# Altium project 皮肤热疗.PrjPCB
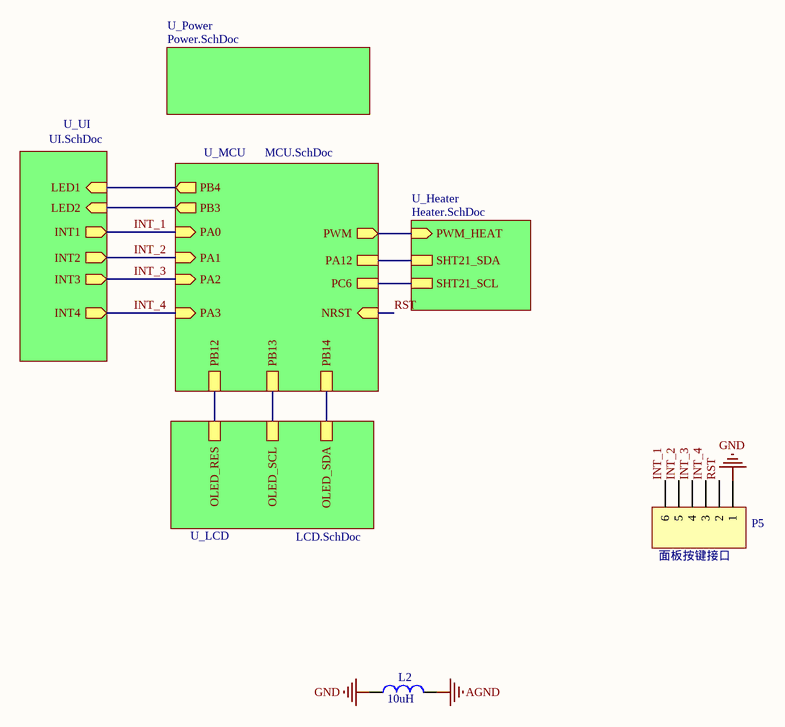
[diagram p0: Top.SchDoc]
6 sheets, 64 parts. Net scope: hierarchical (ports join the sheet entries above them; power ports are global).
Board file: 皮肤热疗.PcbDoc
Sheets:
  Top.SchDoc
    U_MCU = MCU.SchDoc
    U_Heater = Heater.SchDoc
    U_LCD = LCD.SchDoc
    U_Power = Power.SchDoc
    U_UI = UI.SchDoc

## Sheet Top.SchDoc
size A4

### Parts
L2  value 10uH  [0805]  (hidden comment: Inductor)
P5  面板按键接口  [软排线插座6P-0.5mm]

### Sub-sheets
U_Heater = Heater.SchDoc: SHT21_SCL, SHT21_SDA, PWM_HEAT (in)
U_LCD = LCD.SchDoc: OLED_SDA, OLED_SCL, OLED_RES
U_MCU = MCU.SchDoc: PWM (out), NRST (in), PA0 (in), PA1 (in), PA2 (in), PA3 (in), PB12, PB13, PB14, PB3 (out), PB4 (out), PC6, PA12
U_Power = Power.SchDoc: no entries
U_UI = UI.SchDoc: INT1 (out), INT2 (out), INT3 (out), INT4 (out), LED1 (in), LED2 (in)

### Nets
AGND: L2.2
GND: L2.1 P5.1
INT_1: P5.6 ; sheet U_MCU/PA0, sheet U_UI/INT1
INT_2: P5.5 ; sheet U_MCU/PA1, sheet U_UI/INT2
INT_3: P5.4 ; sheet U_MCU/PA2, sheet U_UI/INT3
INT_4: P5.3 ; sheet U_MCU/PA3, sheet U_UI/INT4
RST: P5.2 ; sheet U_MCU/NRST  [project net NRST]
NetQ1_1: sheet U_MCU/PWM, sheet U_Heater/PWM_HEAT
NetR1_2: sheet U_MCU/PC6, sheet U_Heater/SHT21_SCL
NetR2_2: sheet U_MCU/PA12, sheet U_Heater/SHT21_SDA
NetR19_2: sheet U_MCU/PB4, sheet U_UI/LED1
NetR20_2: sheet U_MCU/PB3, sheet U_UI/LED2
NetU2_3: sheet U_MCU/PB14, sheet U_LCD/OLED_SDA
NetU2_4: sheet U_MCU/PB13, sheet U_LCD/OLED_SCL
NetU2_5: sheet U_MCU/PB12, sheet U_LCD/OLED_RES

### Library data of the parts
P5 = Header 6: Header, 6-Pin; LatestRevisionDate: 17-Jul-2002; LatestRevisionNote: Re-released for DXP Platform.; Publisher: Altium Limited

## Sheet MCU.SchDoc
size A4
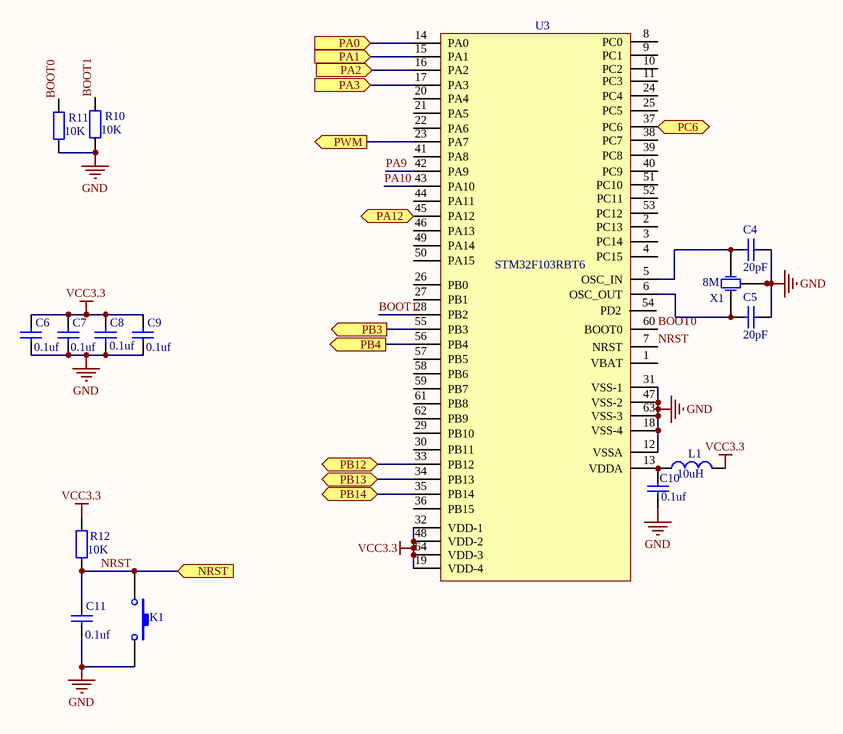
[diagram p1: MCU.SchDoc]

### Parts
C4  value 20pF  [0603]  (hidden comment: Capacitor-0805)
C5  value 20pF  [0603]  (hidden comment: Capacitor-0805)
C6  value 0.1uf  [0603]  (hidden comment: Capacitor-0603)
C7  value 0.1uf  [0603]  (hidden comment: Capacitor-0603)
C8  value 0.1uf  [0603]  (hidden comment: Capacitor-0603)
C9  value 0.1uf  [0603]  (hidden comment: Capacitor-0603)
C10  value 0.1uf  [0603]  (hidden comment: Capacitor-0603)
C11  value 0.1uf  [0603]  (hidden comment: Capacitor-0603)
K1  按键  [mini按键]  (value not drawn)
L1  value 10uH  [0805]  (hidden comment: Inductor)
R10  value 10K  [0603]  (hidden comment: Resistor-0603)
R11  value 10K  [0603]  (hidden comment: Resistor-0603)
R12  value 10K  [0603]  (hidden comment: Resistor-0603)
U3  STM32F103RBT6  [STM32F103RBT6]
X1  value 8M  [3225无源晶振]  (hidden comment: 3225无源晶振)

### Ports
NRST (in), PA0 (in), PA1 (in), PA2 (in), PA3 (in), PA12, PB3 (out), PB4 (out), PB12, PB13, PB14, PC6, PWM (out)

### Nets
GND: C4.1 C5.1 C6.1 C7.1 C8.1 C9.1 C10.1 C11.1 K1.2 R10.1 R11.1 U3.12(VSSA) U3.18(VSS-4) U3.31(VSS-1) U3.47(VSS-2) U3.63(VSS-3) X1.2(GND) X1.4(GND)
VCC3.3: C6.2 C7.2 C8.2 C9.2 L1.2 R12.2 U3.19(VDD-4) U3.32(VDD-1) U3.48(VDD-2) U3.64(VDD-3)
BOOT0: R11.2 U3.60(BOOT0)
BOOT1: R10.2 U3.28(PB2)
INT_1: U3.14(PA0) ; port PA0
INT_2: U3.15(PA1) ; port PA1
INT_3: U3.16(PA2) ; port PA2
INT_4: U3.17(PA3) ; port PA3
NRST: C11.2 K1.1 R12.1 U3.7(NRST) ; port NRST
PA9: U3.42(PA9)
PA10: U3.43(PA10)
NetC4_2: C4.2 U3.5(OSC_IN) X1.3(OSC2)
NetC5_2: C5.2 U3.6(OSC_OUT) X1.1(OSC1)
NetC10_2: C10.2 L1.1 U3.13(VDDA)
NetQ1_1: U3.23(PA7) ; port PWM
NetR1_2: U3.37(PC6) ; port PC6
NetR2_2: U3.45(PA12) ; port PA12
NetR19_2: U3.56(PB4) ; port PB4
NetR20_2: U3.55(PB3) ; port PB3
NetU2_3: U3.35(PB14) ; port PB14
NetU2_4: U3.34(PB13) ; port PB13
NetU2_5: U3.33(PB12) ; port PB12

Not connected (* = marked no-connect by the designer): U3 1(VBAT) 2(PC13) 3(PC14) 4(PC15) 8(PC0) 9(PC1) 10(PC2) 11(PC3) 20(PA4) 21(PA5) 22(PA6) 24(PC4) 25(PC5) 26(PB0) 27(PB1) 29(PB10) 30(PB11) 36(PB15) 38(PC7) 39(PC8) 40(PC9) 41(PA8) 44(PA11) 46(PA13) 49(PA14) 50(PA15) 51(PC10) 52(PC11) 53(PC12) 54(PD2) 57(PB5) 58(PB6) 59(PB7) 61(PB8) 62(PB9)

### Library data of the parts
C4 C5 = Capacitor-0
U3 = STM32F103RBT6: Name: STM32F103RBT6

## Sheet Heater.SchDoc
size A4
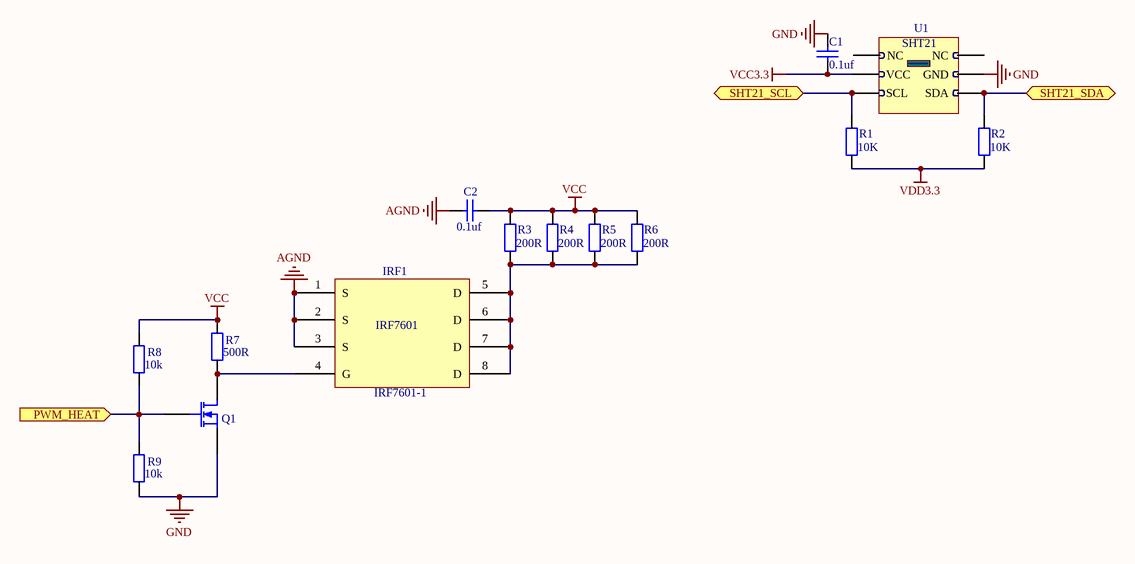
[diagram p2: Heater.SchDoc]

### Parts
C1  value 0.1uf  [0603]  (hidden comment: Capacitor-0603)
C2  value 0.1uf  [0603]  (hidden comment: Capacitor-0603)
IRF1  IRF7601-1  [IRF7601_Micro]
Q1  MOSFET_N  [MOSFET_N]  (value not drawn)
R1  value 10K  [0603]  (hidden comment: Resistor-0603)
R2  value 10K  [0603]  (hidden comment: Resistor-0603)
R3  value 200R  [0805]  (hidden comment: Resistor-0805)
R4  value 200R  [0805]  (hidden comment: Resistor-0805)
R5  value 200R  [0805]  (hidden comment: Resistor-0805)
R6  value 200R  [0805]  (hidden comment: Resistor-0805)
R7  value 500R  [0603]  (hidden comment: Resistor-0603)
R8  value 10k  [0603]  (hidden comment: Resistor-0603)
R9  value 10k  [0603]  (hidden comment: Resistor-0603)
U1  SHIT21  [SHT21]  (value not drawn)

### Ports
PWM_HEAT (in), SHT21_SCL, SHT21_SDA

### Nets
AGND: C2.2 IRF1.1(S) IRF1.2(S) IRF1.3(S)
GND: C1.2 Q1.2(S) R9.1 U1.4(GND)
VCC: C2.1 R3.2 R4.2 R5.2 R6.2 R7.2 R8.2
VCC3.3: C1.1 U1.3(VCC)
VDD3.3: R1.1 R2.1
NetIRF1_4: IRF1.4(G) Q1.3(D) R7.1
NetIRF1_5: IRF1.5(D) IRF1.6(D) IRF1.7(D) IRF1.8(D) R3.1 R4.1 R5.1 R6.1
NetQ1_1: Q1.1(G) R8.1 R9.2 ; port PWM_HEAT
NetR1_2: R1.2 U1.5(SCL) ; port SHT21_SCL
NetR2_2: R2.2 U1.6(SDA) ; port SHT21_SDA

Not connected (* = marked no-connect by the designer): U1 1(NC) 2(NC)

### Library data of the parts
IRF1 = Component_1: IRF7601
Q1 = MOSFET_N: Value: AP2306N; Name: MOSFET_N
U1 = SHIT21: Name: SHT21

## Sheet LCD.SchDoc
size A4
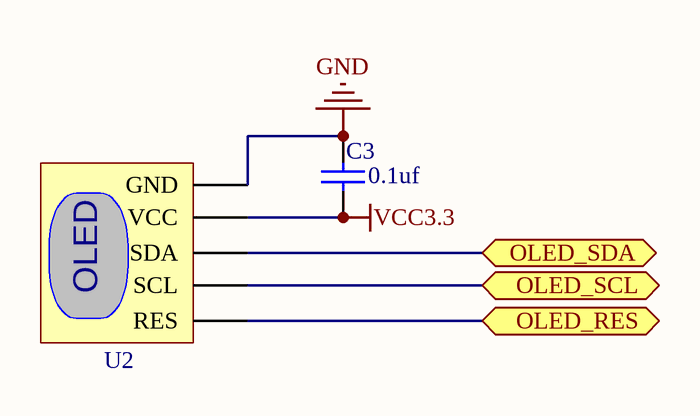
[diagram p3: LCD.SchDoc]

### Parts
C3  value 0.1uf  [0603]  (hidden comment: Capacitor-0603)
U2  0.49OLED  [0.49OLED]  (value not drawn)

### Ports
OLED_RES, OLED_SCL, OLED_SDA

### Nets
GND: C3.2 U2.1(GND)
VCC3.3: C3.1 U2.2(VCC)
NetU2_3: U2.3(SDA) ; port OLED_SDA
NetU2_4: U2.4(SCL) ; port OLED_SCL
NetU2_5: U2.5(RES) ; port OLED_RES

### Notes on the sheet
- (in symbol 0.49OLED) OLED

### Library data of the parts
U2 = 0.49OLED: Name: 0.49OLED

## Sheet Power.SchDoc
size A4
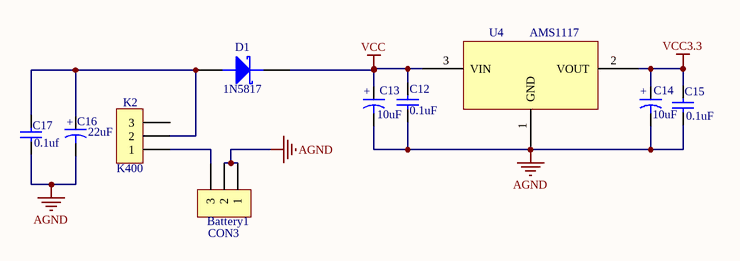
[diagram p4: Power.SchDoc]

### Parts
Battery1  CON3  [J-SOURCE-micro]
C12  value 0.1uF  [0805]  (hidden comment: Capacitor-0805)
C13  value 10uF  [钽电容1206（A3216）]  (hidden comment: 电解电容)
C14  value 10uF  [钽电容1206（A3216）]  (hidden comment: 电解电容)
C15  value 0.1uF  [0805]  (hidden comment: Capacitor-0805)
C16  value 22uF  [钽电容1206（A3216）]  (hidden comment: 电解电容)
C17  value 0.1uf  [0603]  (hidden comment: Capacitor-0603)
D1  1N5817  [1808]
K2  K400  [SS-12D01-edit]
U4  Name: AMS1117  [AMS1117-3.3(SOT-23)]  (hidden comment: AMS1117-3.3)

### Nets
AGND: Battery1.1 Battery1.2 C12.1 C13.1 C14.1 C15.1 C16.1 C17.1 U4.1(GND)
VCC: C12.2 C13.2 D1.2(K) U4.3(VIN)
VCC3.3: C14.2 C15.2 U4.2(VOUT)
NetBattery1_3: Battery1.3 K2.1
NetC16_2: C16.2 C17.2 D1.1(A) K2.2

Not connected (* = marked no-connect by the designer): K2 3

### Notes on the sheet
- (in symbol 电解电容) +

### Library data of the parts
Battery1 K2 = CON3: Connector
D1 = DIODE SCHOTTKY: Schottky Diode

## Sheet UI.SchDoc
size A4
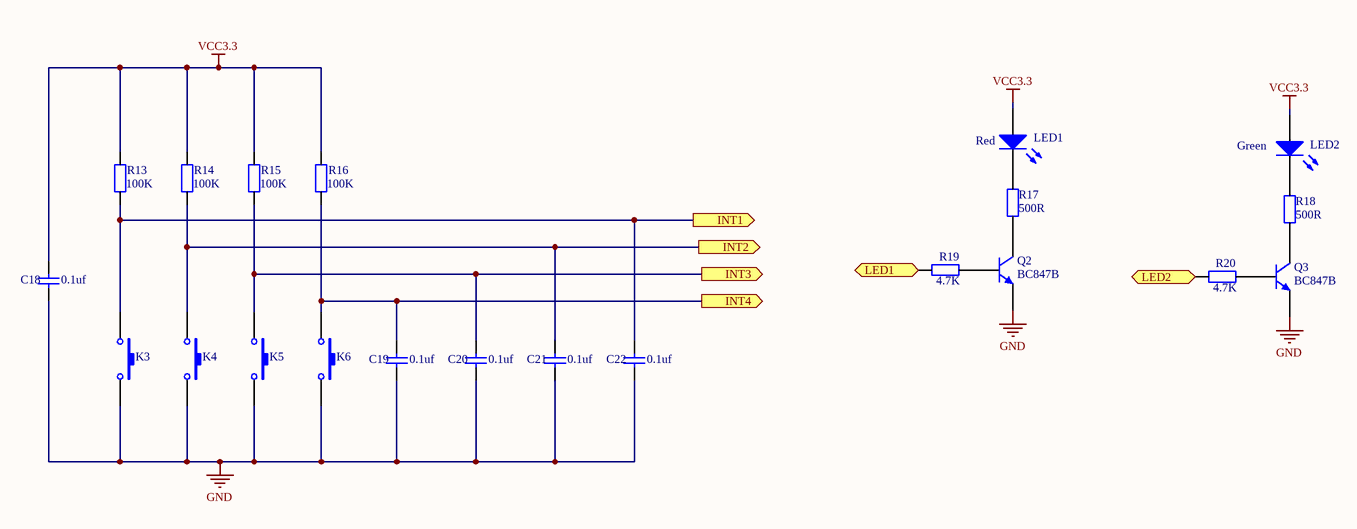
[diagram p5: UI.SchDoc]

### Parts
C18  value 0.1uf  [0603]  (hidden comment: Capacitor-0603)
C19  value 0.1uf  [0603]  (hidden comment: Capacitor-0603)
C20  value 0.1uf  [0603]  (hidden comment: Capacitor-0603)
C21  value 0.1uf  [0603]  (hidden comment: Capacitor-0603)
C22  value 0.1uf  [0603]  (hidden comment: Capacitor-0603)
K3  按键  [mini按键]  (value not drawn)
K4  按键  [mini按键]  (value not drawn)
K5  按键  [mini按键]  (value not drawn)
K6  按键  [mini按键]  (value not drawn)
LED1  Color: Red  [外插小灯]  (hidden comment: LED)
LED2  Color: Green  [外插小灯]  (hidden comment: LED)
Q2  BC847  [BC847B]  (value not drawn)
Q3  BC847  [BC847B]  (value not drawn)
R13  value 100K  [0603]  (hidden comment: Resistor-0603)
R14  value 100K  [0603]  (hidden comment: Resistor-0603)
R15  value 100K  [0603]  (hidden comment: Resistor-0603)
R16  value 100K  [0603]  (hidden comment: Resistor-0603)
R17  value 500R  [0603]  (hidden comment: Resistor-0603)
R18  value 500R  [0603]  (hidden comment: Resistor-0603)
R19  value 4.7K  [0603]  (hidden comment: Resistor-0603)
R20  value 4.7K  [0603]  (hidden comment: Resistor-0603)

### Ports
INT1 (out), INT2 (out), INT3 (out), INT4 (out), LED1 (in), LED2 (in)

### Nets
GND: C18.1 C19.1 C20.1 C21.1 C22.1 K3.2 K4.2 K5.2 K6.2 Q2.1(E) Q3.1(E)
VCC3.3: C18.2 LED1.1(A) LED2.1(A) R13.2 R14.2 R15.2 R16.2
INT_1: C22.2 K3.1 R13.1 ; port INT1
INT_2: C21.2 K4.1 R14.1 ; port INT2
INT_3: C20.2 K5.1 R15.1 ; port INT3
INT_4: C19.2 K6.1 R16.1 ; port INT4
NetLED1_2: LED1.2 R17.2
NetLED2_2: LED2.2 R18.2
NetQ2_2: Q2.2(B) R19.1
NetQ2_3: Q2.3(C) R17.1
NetQ3_2: Q3.2(B) R20.1
NetQ3_3: Q3.3(C) R18.1
NetR19_2: R19.2 ; port LED1
NetR20_2: R20.2 ; port LED2

### Library data of the parts
LED1 LED2 = LED: Value: LED
Q2 Q3 = BC847: Name: BC847B

## Nets that join several sheets
AGND: Top (L2.2), Heater (C2.2 IRF1.1 IRF1.2 IRF1.3), Power (9 pins)
GND: Top (L2.1 P5.1), MCU (18 pins), Heater (C1.2 Q1.2 R9.1 U1.4), LCD (C3.2 U2.1), UI (11 pins)
VCC: Heater (7 pins), Power (C12.2 C13.2 D1.2 U4.3)
VCC3.3: MCU (10 pins), Heater (C1.1 U1.3), LCD (C3.1 U2.2), Power (C14.2 C15.2 U4.2), UI (7 pins)
INT_1: Top (P5.6), MCU (U3.14), UI (C22.2 K3.1 R13.1)
INT_2: Top (P5.5), MCU (U3.15), UI (C21.2 K4.1 R14.1)
INT_3: Top (P5.4), MCU (U3.16), UI (C20.2 K5.1 R15.1)
INT_4: Top (P5.3), MCU (U3.17), UI (C19.2 K6.1 R16.1)
NetQ1_1: MCU (U3.23), Heater (Q1.1 R8.1 R9.2)
NetR1_2: MCU (U3.37), Heater (R1.2 U1.5)
NetR2_2: MCU (U3.45), Heater (R2.2 U1.6)
NetR19_2: MCU (U3.56), UI (R19.2)
NetR20_2: MCU (U3.55), UI (R20.2)
NetU2_3: MCU (U3.35), LCD (U2.3)
NetU2_4: MCU (U3.34), LCD (U2.4)
NetU2_5: MCU (U3.33), LCD (U2.5)
NRST: Top (P5.2), MCU (C11.2 K1.1 R12.1 U3.7)